# Altium schematic sheet MDQARM_POWER.SchDoc
size A3; Organization: Altium Limited; Address1: L3, 12a Rodborough Rd; Address2: Frenchs Forest; Address3: NSW; Address4: Australia 2086
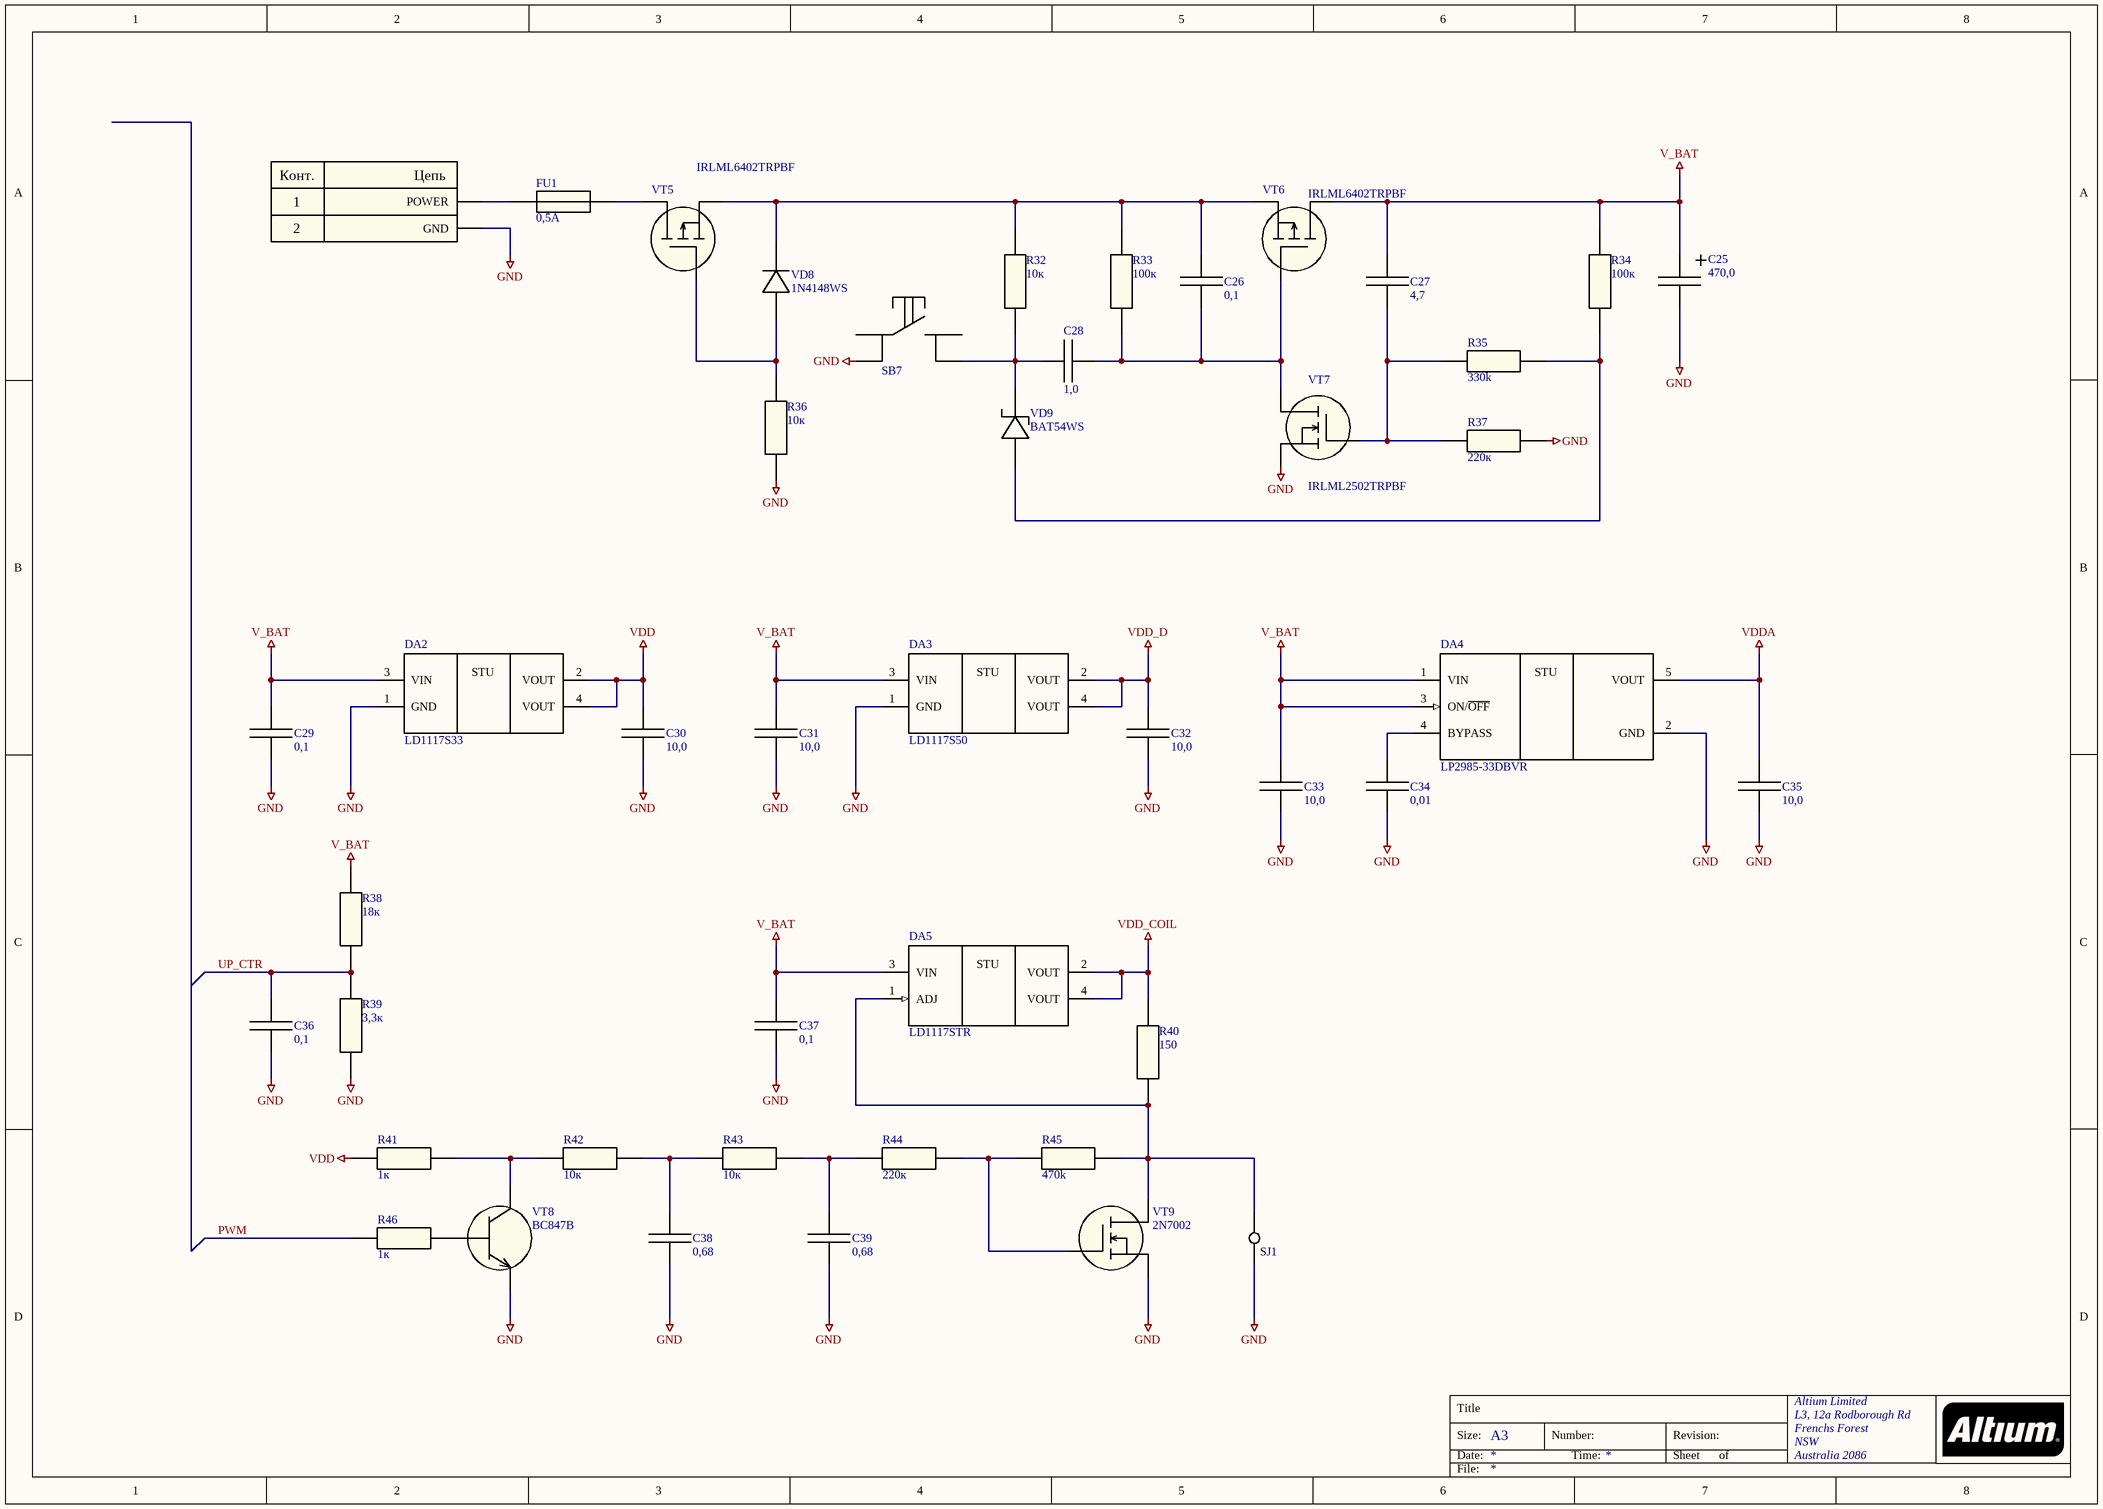
[diagram p0: MDQARM_POWER.SchDoc]

## Parts
*2  Connector MD_POWER  [Connector MD_POWER]  (value not drawn)
C25  470,0  [Capacitor ECAP SMD10x10.5]
C26  0,1  [Capacitor SMD0805-T0.95]
C27  4,7  [Capacitor SMD0805-T1.35]
C28  1,0  [Capacitor SMD0805-T1.35]
C29  0,1  [Capacitor SMD0805-T0.95]
C30  10,0  [Capacitor SMD0805-T1.35]
C31  10,0  [Capacitor SMD0805-T1.35]
C32  10,0  [Capacitor SMD0805-T1.35]
C33  10,0  [Capacitor SMD0805-T1.35]
C34  0,01  [Capacitor SMD0805-T0.75]
C35  10,0  [Capacitor SMD0805-T1.35]
C36  0,1  [Capacitor SMD0805-T0.95]
C37  0,1  [Capacitor SMD0805-T0.95]
C38  0,68  [Capacitor SMD0805-T0.95]
C39  0,68  [Capacitor SMD0805-T0.95]
DA2  LD1117S33  [IC LD1117S33]
DA3  LD1117S50  [IC LD1117S50]
DA4  LP2985-33DBVR  [IC LP2985-33DBVR]
DA5  LD1117STR  [IC LD1117STR]
FU1  0,5А  [Fuse MF-NSMF]
R32  10к  [Resistor SMD0805]
R33  100к  [Resistor SMD0805]
R34  100к  [Resistor SMD0805]
R35  330k  [Resistor SMD0805]
R36  10к  [Resistor SMD0805]
R37  220к  [Resistor SMD0805]
R38  18к  [Resistor SMD0805]
R39  3,3к  [Resistor SMD0805]
R40  150  [Resistor SMD0805]
R41  1к  [Resistor SMD0805]
R42  10к  [Resistor SMD0805]
R43  10к  [Resistor SMD0805]
R44  220к  [Resistor SMD0805]
R45  470k  [Resistor SMD0805]
R46  1к  [Resistor SMD0805]
SB7  KLS7-TS6604-4.3-180  [Button KLS7-TS6604-4.3-180]  (value not drawn)
SJ1  SolderJump 1  [SolderJump 1]  (value not drawn)
VD8  1N4148WS  [Diode SOD-323]
VD9  BAT54WS  [Diode SOD-323]
VT5  IRLML6402TRPBF  [Transistor SOT23]
VT6  IRLML6402TRPBF  [Transistor SOT23]
VT7  IRLML2502TRPBF  [Transistor SOT23]
VT8  BC847B  [Transistor SOT23]
VT9  2N7002  [Transistor SOT23]

## Nets
GND: *2.2(GND) C25.2 C29.1 C30.1 C31.1 C32.1 C33.1 C34.1 C35.1 C36.1 C37.1 C38.1 C39.1 DA2.1(GND) DA3.1(GND) DA4.2(GND) R36.1 R37.2 R39.1 SB7.2 SJ1.1 VT7.2(S) VT8.2(E) VT9.2(S)
V_BAT: C25.1 C27.2 C29.2 C31.2 C33.2 C37.2 DA2.3(VIN) DA3.3(VIN) DA4.1(VIN) DA4.3(ON/~{OFF}) DA5.3(VIN) R34.2 R38.2 VT6.3(D)
VDD: C30.2 DA2.2(VOUT) DA2.4(VOUT) R41.1
VDD_COIL: DA5.2(VOUT) DA5.4(VOUT) R40.1
VDD_D: C32.2 DA3.2(VOUT) DA3.4(VOUT)
VDDA: C35.2 DA4.5(VOUT)
PWM: R46.1
UP_CTR: C36.2 R38.1 R39.2
Net*2_1: *2.1(POWER) FU1.1
NetC26_1: C26.1 C28.2 R33.1 VT6.1(G) VT7.3(D)
NetC26_2: C26.2 R32.2 R33.2 VD8.2(C) VT5.2(S) VT6.2(S)
NetC27_1: C27.1 R35.1 R37.1 VT7.1(G)
NetC28_1: C28.1 R32.1 SB7.3 VD9.2(C)
NetC34_2: C34.2 DA4.4(BYPASS)
NetC38_2: C38.2 R42.2 R43.1
NetC39_2: C39.2 R43.2 R44.1
NetDA5_1: DA5.1(ADJ) R40.2 R45.2 SJ1.2 VT9.3(D)
NetFU1_2: FU1.2 VT5.3(D)
NetR34_1: R34.1 R35.2 VD9.1(A)
NetR36_2: R36.2 VD8.1(A) VT5.1(G)
NetR41_2: R41.2 R42.1 VT8.3(C)
NetR44_2: R44.2 R45.1 VT9.1(G)
NetR46_2: R46.2 VT8.1(B)

Not connected (* = marked no-connect by the designer): SB7 1 4

## Notes on the sheet
- Title
- Size:
- Date:
- A3
- Number:
- Time:
- Revision:
- Sheet
- of
- File:
- (in symbol Connector MD_POWER) Конт.; Цепь
- (in symbol IC LD1117S33) STU
- (in symbol IC LD1117S50) STU
- (in symbol IC LD1117STR) STU
- (in symbol IC LP2985-33DBVR) STU

## Library data of the parts
C25 = Capacitor ECAP SMD 470uF_16V: Value: 470,0
C26 C29 C36 C37 = Capacitor C0805_100n: Value: 0,1
C27 = Capacitor C0805_4.7u: Value: 4,7
C28 = Capacitor C0805_1u: Value: 1,0
C30-C33 C35 = Capacitor C0805_10u: Value: 10,0
C34 = Capacitor C0805_10n: Value: 0,01
C38 C39 = Capacitor C0805_680n: Value: 0,68
DA2 = IC LD1117S33: Value: LD1117S33
DA3 = IC LD1117S50: Value: LD1117S50
DA4 = IC LP2985-33DBVR: Value: LP2985-33DBVR
DA5 = IC LD1117STR: Value: LD1117STR
FU1 = Fuse MF-NSMF050-2: Value: 0,5А
R32 R36 R42 R43 = Resistor R0805_10k_5%: Value: 10к
R33 R34 = Resistor R0805_100k_5%: Value: 100к
R35 = Resistor R0805_330k_5%: Value: 330к
R37 R44 = Resistor R0805_220k_5%: Value: 220к
R38 = Resistor R0805_18k_5%: Value: 18к
R39 = Resistor R0805_3.3k_5%: Value: 3,3к
R40 = Resistor R0805_150_5%: Value: 150
R41 R46 = Resistor R0805_1k_5%: Value: 1к
R45 = Resistor R0805_470k_5%: Value: 470к
SB7 = Button KLS7-TS6604-4.3-180: SMD Tact Switch 4.3mm; Value: KLS7-TS6604-4.3-180
VD8 = Diode 1N4148WS: 150mA 100V 4ns
VD9 = Diode BAT54WS: 200mA 30V Schottky
VT5 VT6 = Transistor IRLML6402TRPBF: Value: IRLML6402TRPBF
VT7 = Transistor IRLML2502TRPBF: Value: IRLML2502TRPBF
VT8 = Transistor BC847B: Value: BC847B
VT9 = Transistor 2N7002: Value: 2N7002